# EAGLE schematic spi_dac (EAGLE 7.6.0)
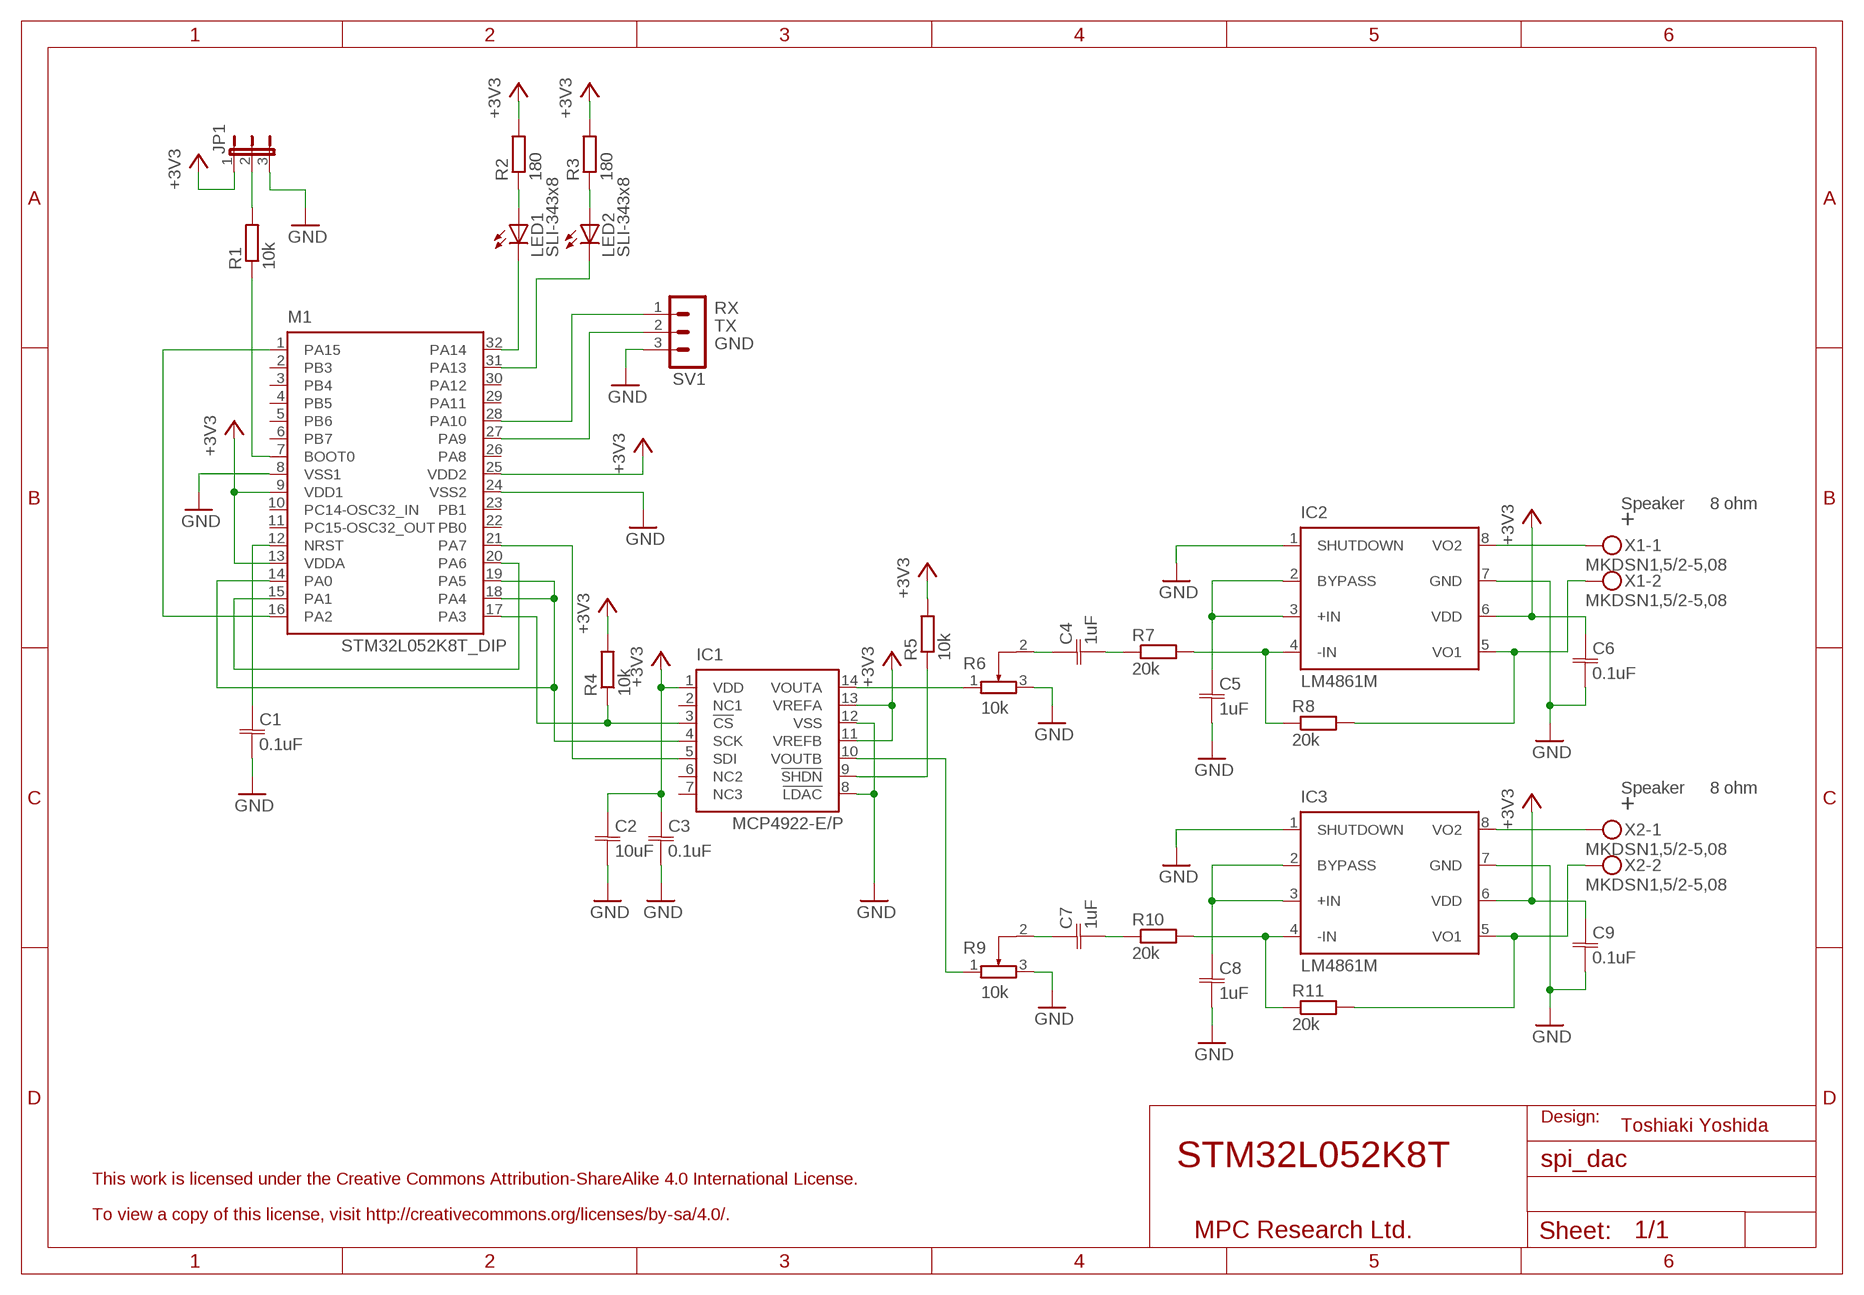
[diagram p0: schematic, sheet 1]

## Parts
C1  0.1uF  C-JIS050-024X044  [C050-024X044]
C2  10uF  C-JIS050-024X044  [C050-024X044]
C3  0.1uF  C-JIS050-024X044  [C050-024X044]
C4  1uF  C-JIS050-024X044  [C050-024X044]
C5  1uF  C-JIS050-024X044  [C050-024X044]
C6  0.1uF  C-JIS050-024X044  [C050-024X044]
C7  1uF  C-JIS050-024X044  [C050-024X044]
C8  1uF  C-JIS050-024X044  [C050-024X044]
C9  0.1uF  C-JIS050-024X044  [C050-024X044]
IC1  MCP4922-E/P  [DIL14]
IC2  LM4861M  [SO-08]
IC3  LM4861M  [SO-08]
JP1  JP2E  [JP2]
LED1  SLI-343x8  LED3MM  [LED3MM]
LED2  SLI-343x8  LED3MM  [LED3MM]
M1  STM32L052K8T_DIP  [DIP32]
R1  10k  R-EU_0207/2V  [0207/2V]
R2  180  R-EU_0207/2V  [0207/2V]
R3  180  R-EU_0207/2V  [0207/2V]
R4  10k  R-EU_0207/2V  [0207/2V]
R5  10k  R-EU_0207/2V  [0207/2V]
R6  10k  TSR-3386T-EY5  [TSR-3386T]
R7  20k  R-EU_0207/2V  [0207/2V]
R8  20k  R-EU_0207/10  [0207/10]
R9  10k  TSR-3386T-EY5  [TSR-3386T]
R10  20k  R-EU_0207/2V  [0207/2V]
R11  20k  R-EU_0207/10  [0207/10]
SV1  MA03-1  [MA03-1]
X1  MKDSN1,5/2-5,08  [MKDSN1,5/2-5,08]
X2  MKDSN1,5/2-5,08  [MKDSN1,5/2-5,08]

## Nets
+3V3: C2.1 C3.1 C6.1 C9.1 IC1.1(VDD) IC1.11(VREFB) IC1.13(VREFA) IC2.6(VDD) IC3.6(VDD) JP1.1 M1.9(VDD1) M1.13(VDDA) M1.25(VDD2) R2.2 R3.2 R4.2 R5.2
GND: C1.2 C2.2 C3.2 C5.2 C6.2 C8.2 C9.2 IC1.8(!LDAC) IC1.12(VSS) IC2.1(SHUTDOWN) IC2.7(GND) IC3.1(SHUTDOWN) IC3.7(GND) JP1.3 M1.8(VSS1) M1.24(VSS2) R6.3 R9.3 SV1.3
N$1: M1.27(PA9) SV1.2
N$2: M1.7(BOOT0) R1.1
N$3: M1.28(PA10) SV1.1
N$4: C1.1 M1.12(NRST)
N$5: LED1.K(C) M1.32(PA14)
N$6: JP1.2 R1.2
N$7: LED2.A R3.1
N$8: LED2.K(C) M1.31(PA13)
N$9: LED1.A R2.1
N$10: IC1.9(!SHDN) R5.1
N$11: IC1.4(SCK) M1.14(PA0) M1.18(PA4) M1.19(PA5)
N$12: IC1.5(SDI) M1.21(PA7)
N$14: C4.1 R6.2
N$15: IC1.10(VOUTB) R9.1
N$16: IC2.4(-IN) R7.2 R8.1
N$17: C4.2 R7.1
N$18: C5.1 IC2.2(BYPASS) IC2.3(+IN)
N$19: IC1.14(VOUTA) R6.1
N$20: IC2.5(VO1) R8.2 X1.2
N$21: C7.1 R9.2
N$22: C7.2 R10.1
N$23: IC3.4(-IN) R10.2 R11.1
N$24: C8.1 IC3.2(BYPASS) IC3.3(+IN)
N$25: IC3.5(VO1) R11.2 X2.2
N$26: IC2.8(VO2) X1.1
N$27: IC3.8(VO2) X2.1
N$28: M1.1(PA15) M1.16(PA2)
N$29: M1.15(PA1) M1.20(PA6)
N$30: IC1.3(!CS) M1.17(PA3) R4.1
Unconnected: IC1.2(NC1) IC1.6(NC2) IC1.7(NC3) M1.2(PB3) M1.3(PB4) M1.4(PB5) M1.5(PB6) M1.6(PB7) M1.10(PC14-OSC32_IN) M1.11(PC15-OSC32_OUT) M1.22(PB0) M1.23(PB1) M1.26(PA8) M1.29(PA11) M1.30(PA12)

## Notes on the sheet
- RX
- TX
- GND
- Speaker | 8 ohm
- +
- Speaker | 8 ohm
- +
- Design:
- Toshiaki Yoshida
- STM32L052K8T
- This work is licensed under the Creative Commons Attribution-ShareAlike 4.0 International License.
- To view a copy of this license, visit http://creativecommons.org/licenses/by-sa/4.0/.
- MPC Research Ltd.

## Library data of the parts
C1-C9 = cap:C-JIS: CAPACITOR, Japanese symbol
IC1 = microchip:MCP49*2-E: MCP4902/4912/4922 Microchip 8/10/12-Bit Dual Voltage Output Digital-to-Analog Converter with SPI Interface
IC2 IC3 = ti:LM4861M: 1.1W Audio Power Amplifier with Shutdown Mode
JP1 = jumper:JP2E: JUMPER
LED1 LED2 = led:LED: LED OSRAM: - CHIPLED LG R971, LG N971, LY N971, LG Q971, LY Q971, LO R971, LY R971 LH N974, LH R974 LS Q976, LO Q976, LY Q976 LO Q996 - Hyper CHIPLED LW Q18S LB Q993, LB Q99A, LB R99A - SideLED LS A670, LO A670, LY A670, LG A670, LP A670 LB A673, LV A673, LT A673, LW A673 LH A674 LY A675 LS A676, LA A676, LO A676, LY A676, LW A676 LS A679, LY A679, LG A679 - Hyper Micro SIDELED® LS Y876, LA Y876, LO Y876, LY Y876 LT Y87S - SmartLED LW L88C, LW L88S LB L89C, LB L89S, LG L890 LS L89K, LO L89K, LY L89K LS L896, LA L896, LO L896, LY L896 - TOPLED LS T670, LO T670, LY T670, LG T670, LP T670 LSG T670, LSP T670, LSY T670, LOP T670, LYG T670 LG T671, LOG T671, LSG T671 LB T673, LV T673, LT T673, LW T673 LH T674 LS T676, LA T676, LO T676, LY T676, LB T676, LH T676, LSB T676, LW T676 LB T67C, LV T67C, LT T67C, LS T67K, LO T67K, LY T67K, LW E67C LS E67B, LA E67B, LO E67B, LY E67B, LB E67C, LV E67C, LT E67C LW T67C LS T679, LY T679, LG T679 LS T770, LO T770, LY T770, LG T770, LP T770 LB T773, LV T773, LT T773, LW T773 LH T774 LS E675, LA E675, LY E675, LS T675 LS T776, LA T776, LO T776, LY T776, LB T776 LHGB T686 LT T68C, LB T68C - Hyper Mini TOPLED® LB M676 - Mini TOPLED Santana® LG M470 LS M47K, LO M47K, LY M47K Source: http://www.osram.convergy.de LUXEON: - LUMILED® LXK2-PW12-R00, LXK2-PW12-S00, LXK2-PW14-U00, LXK2-PW14-V00 LXK2-PM12-R00, LXK2-PM12-S00, LXK2-PM14-U00 LXK2-PE12-Q00, LXK2-PE12-R00, LXK2-PE12-S00, LXK2-PE14-T00, LXK2-PE14-U00 LXK2-PB12-K00, LXK2-PB12-L00, LXK2-PB12-M00, LXK2-PB14-N00, LXK2-PB14-P00, LXK2-PB14-Q00 LXK2-PR12-L00, LXK2-PR12-M00, LXK2-PR14-Q00, LXK2-PR14-R00 LXK2-PD12-Q00, LXK2-PD12-R00, LXK2-PD12-S00 LXK2-PH12-R00, LXK2-PH12-S00 LXK2-PL12-P00, LXK2-PL12-Q00, LXK2-PL12-R00 Source: www.luxeon.com KINGBRIGHT: KA-3528ASYC Source: www.kingbright.com
M1 = stm32:STM32L052K8T_DIP
R1-R5 R7 R8 R10 R11 = resistor:R-EU_: RESISTOR, European symbol
R6 R9 = pot:TSR-3386T-EY5
SV1 = con-lstb:MA03-1: PIN HEADER; OC_FARNELL: unknown; OC_NEWARK: unknown
X1 X2 = con-phoenix-508:MKDSN1,5/2-5,08: MKDSN 1,5/ 2-5,08 Printklemme Nennstrom: 13,5 A Nennspannung: 250 V Rastermaß: 5,08 mm Polzahl: 2 Anschlussart: Schraubanschluss Montage: Löten Anschlussrichtung Leiter/Platine: 0 ° Artikelnummer: 1729128 Source: http://eshop.phoenixcontact.com .. 1729128.pdf